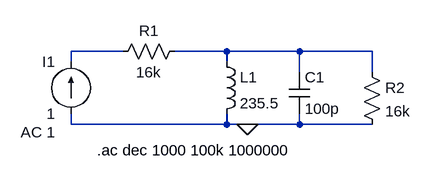
[diagram p0: schematic Draft1.asc]
Draft1.asc, the LTspice schematic file:
Version 4
SHEET 1 880 680
WIRE 64 112 -16 112
WIRE 224 112 144 112
WIRE 336 112 224 112
WIRE 448 112 336 112
WIRE -16 128 -16 112
WIRE 224 128 224 112
WIRE 336 144 336 112
WIRE 448 144 448 112
WIRE -16 224 -16 208
WIRE 224 224 224 208
WIRE 224 224 -16 224
WIRE 256 224 224 224
WIRE 336 224 336 208
WIRE 336 224 256 224
WIRE 448 224 336 224
FLAG 256 224 0
SYMBOL res 160 96 R90
WINDOW 0 0 56 VBottom 2
WINDOW 3 32 56 VTop 2
SYMATTR InstName R1
SYMATTR Value 16k
SYMBOL ind 208 112 R0
SYMATTR InstName L1
SYMATTR Value 235.5
SYMBOL cap 320 144 R0
SYMATTR InstName C1
SYMATTR Value 100p
SYMBOL res 432 128 R0
SYMATTR InstName R2
SYMATTR Value 16k
SYMBOL current -16 208 R180
WINDOW 0 24 80 Left 2
WINDOW 3 24 0 Left 2
WINDOW 123 24 -28 Left 2
WINDOW 39 0 0 Left 2
SYMATTR InstName I1
SYMATTR Value 1
SYMATTR Value2 AC 1
TEXT 24 264 Left 2 !.ac dec 1000 100k 1000000

The netlist it stands for:
* Draft1.asc
R1 N002 N001 16k
L1 N002 0 235.5
C1 N002 0 100p
R2 N002 0 16k
I1 0 N001 1 AC 1
.ac dec 1000 100k 1000000
.backanno
.end